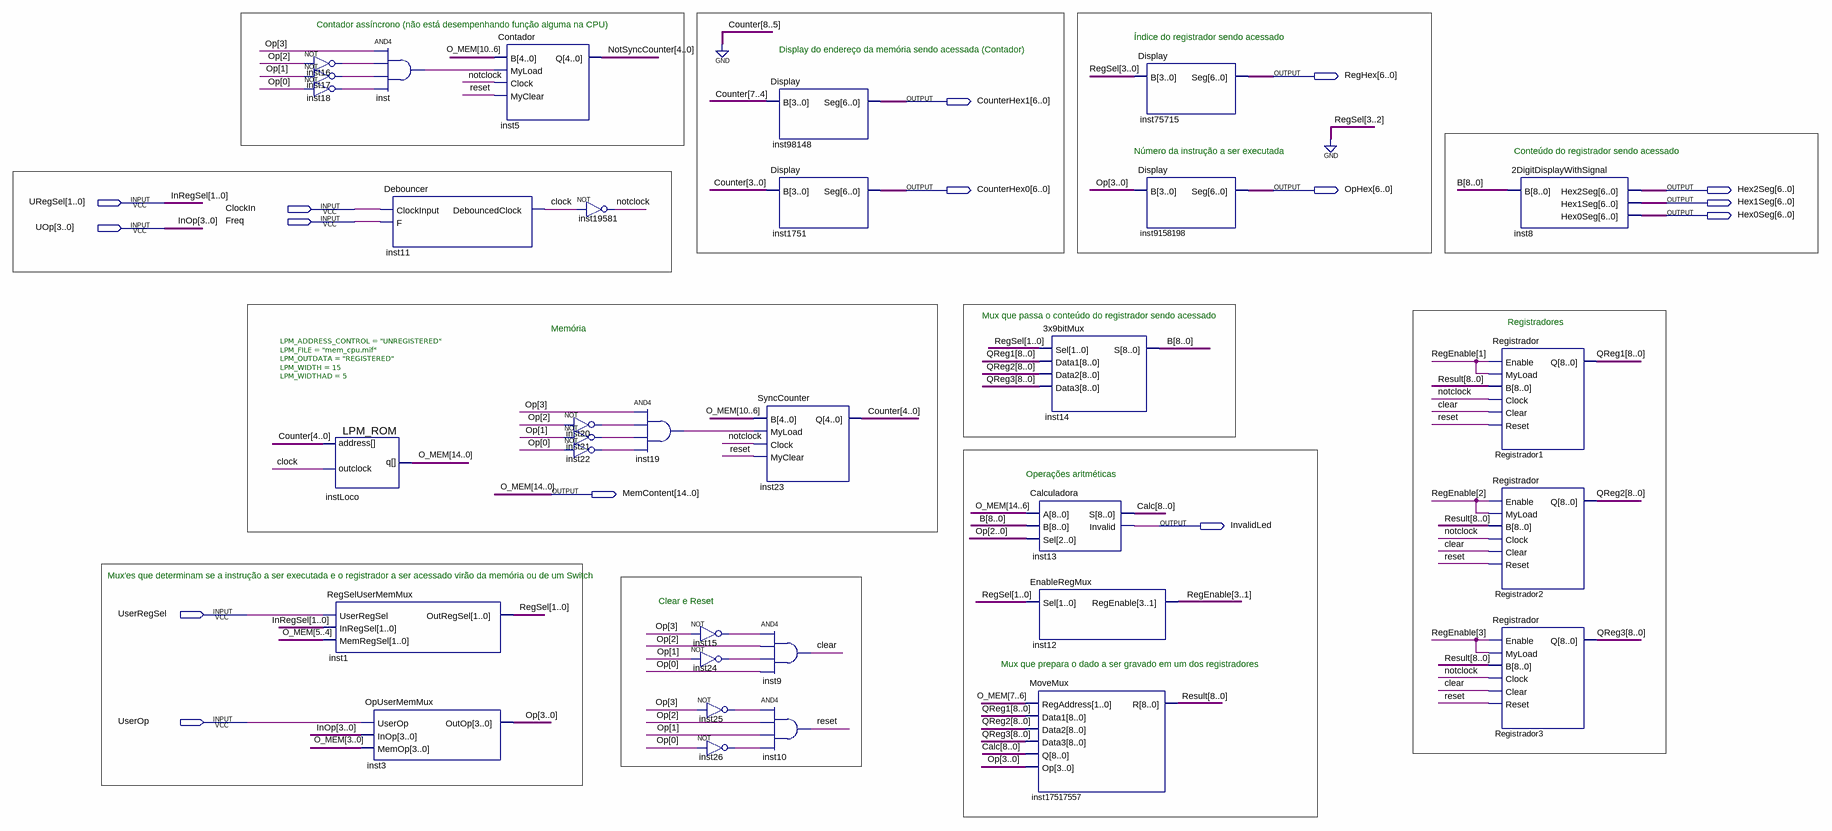
[diagram p0: schematic sheet]
// Quartus schematic cpu.bdf as structural Verilog: 33 symbols, 15 pins
module cpu (
  input  [1:0] URegSel,
  input  ClockIn,
  input  Freq,
  input  [3:0] UOp,
  input  UserRegSel,
  input  UserOp,
  output [6:0] RegHex,
  output [6:0] CounterHex1,
  output [6:0] CounterHex0,
  output [6:0] OpHex,
  output [6:0] Hex2Seg,
  output [6:0] Hex1Seg,
  output [6:0] Hex0Seg,
  output [14:0] MemContent,
  output InvalidLed
);

  wire clear, clock, inst15_out, inst16_out, inst17_out, inst18_out, inst19_out, inst20_out, inst21_out,
       inst22_out, inst24_out, inst25_out, inst26_out, inst_out, notclock, reset;
  wire [1:0] RegSel;
  wire [3:0] Op;
  wire [3:1] RegEnable;
  wire [4:0] Counter, NotSyncCounter;
  wire [8:0] B, Calc, QReg1, QReg2, QReg3, Result;

  not inst16 (inst16_out, Op[2]);
  not inst17 (inst17_out, Op[1]);
  not inst18 (inst18_out, Op[0]);
  LPM_ROM #(.LPM_ADDRESS_CONTROL("UNREGISTERED"), .LPM_FILE("mem_cpu.mif"), .LPM_OUTDATA("REGISTERED"), .LPM_WIDTH(15), .LPM_WIDTHAD(5)) instLoco (
    .address(Counter), .outclock(clock), .q(MemContent));
  RegSelUserMemMux inst1 (.UserRegSel(UserRegSel), .InRegSel(URegSel), .MemRegSel(MemContent[5:4]), .OutRegSel(RegSel));
  OpUserMemMux inst3 (.UserOp(UserOp), .InOp(UOp), .MemOp(MemContent[3:0]), .OutOp(Op));
  and inst (inst_out, Op[3], inst16_out, inst17_out, inst18_out);
  Debouncer inst11 (.ClockInput(ClockIn), .F(Freq), .DebouncedClock(clock));
  Contador inst5 (.B(MemContent[10:6]), .MyLoad(inst_out), .Clock(notclock), .MyClear(reset), .Q(NotSyncCounter));
  not inst20 (inst20_out, Op[2]);
  not inst21 (inst21_out, Op[1]);
  not inst22 (inst22_out, Op[0]);
  not inst19581 (notclock, clock);
  and inst19 (inst19_out, Op[3], inst20_out, inst21_out, inst22_out);
  not inst15 (inst15_out, Op[3]);
  not inst24 (inst24_out, Op[1]);
  not inst25 (inst25_out, Op[3]);
  not inst26 (inst26_out, Op[0]);
  Display inst98148 (.B({3'b000, Counter[4]}), .Seg(CounterHex1));
  Display inst1751 (.B(Counter[3:0]), .Seg(CounterHex0));
  SyncCounter inst23 (.B(MemContent[10:6]), .MyLoad(inst19_out), .Clock(notclock), .MyClear(reset), .Q(Counter));
  and inst9 (clear, inst15_out, Op[2], inst24_out, Op[0]);
  and inst10 (reset, inst25_out, Op[2], Op[1], inst26_out);
  MoveMux inst17517557 (
    .RegAddress(MemContent[7:6]), .Data1(QReg1), .Data2(QReg2), .Data3(QReg3), .Q(Calc), .Op(Op), .R(Result));
  \3x9bitMux  inst14 (.Sel(RegSel), .Data1(QReg1), .Data2(QReg2), .Data3(QReg3), .S(B));
  Calculadora inst13 (.A(MemContent[14:6]), .B(B), .Sel(Op[2:0]), .S(Calc), .Invalid(InvalidLed));
  EnableRegMux inst12 (.Sel(RegSel), .RegEnable(RegEnable));
  Display inst75715 (.B({2'b00, RegSel}), .Seg(RegHex));
  Display inst9158198 (.B(Op), .Seg(OpHex));
  \2DigitDisplayWithSignal  inst8 (.B(B), .Hex2Seg(Hex2Seg), .Hex1Seg(Hex1Seg), .Hex0Seg(Hex0Seg));
  Registrador Registrador1 (
    .Enable(RegEnable[1]), .MyLoad(RegEnable[1]), .B(Result), .Clock(notclock), .Clear(clear), .Reset(reset),
    .Q(QReg1));
  Registrador Registrador2 (
    .Enable(RegEnable[2]), .MyLoad(RegEnable[2]), .B(Result), .Clock(notclock), .Clear(clear), .Reset(reset),
    .Q(QReg2));
  Registrador Registrador3 (
    .Enable(RegEnable[3]), .MyLoad(RegEnable[3]), .B(Result), .Clock(notclock), .Clear(clear), .Reset(reset),
    .Q(QReg3));

  // Other names for the same wires on the sheet: InOp[3:0] = UOp; InRegSel[1:0] = URegSel; O_MEM[14:0] = MemContent

  // Notes on the sheet:
  //   Contador assíncrono (não está desempenhando função alguma na CPU)
  //   Índice do registrador sendo acessado
  //   Display do endereço da memória sendo acessada (Contador)
  //   Número da instrução a ser executada
  //   Conteúdo do registrador sendo acessado
  //   Mux que passa o conteúdo do registrador sendo acessado
  //   Registradores
  //   Memória
  //   Operações aritméticas
  //   Mux'es que determinam se a instrução a ser executada e o registrador a ser acessado virão da memória ou de um Switch
  //   Clear e Reset
  //   Mux que prepara o dado a ser gravado em um dos registradores
endmodule
